# EAGLE schematic ATtiny84 (EAGLE 6.4)
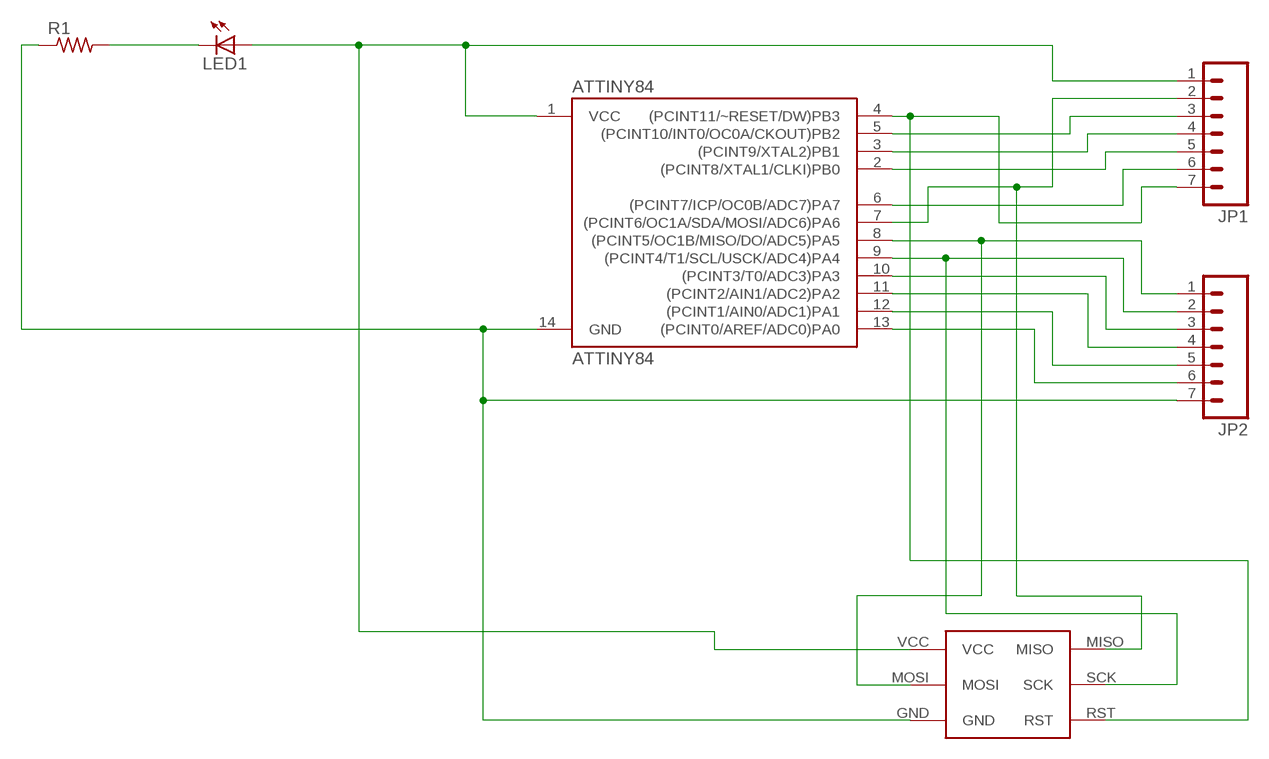
[diagram p0: schematic, sheet 1]

## Parts
ATTINY84  ATTINY84  [SO14]
JP1  M07  [1X07]
JP2  M07  [1X07]
LED1  LEDSML0603  [SML0603]
R1  R-US_R0805W  [R0805W]
U$2  POGO_PIN_SPI_PAD  [POGO_PIN_SPI_PAD]

## Nets
GND: ATTINY84.14(GND) JP2.7 R1.1 U$2.GND
N$1: LED1.C R1.2
PA0: ATTINY84.13((PCINT0/AREF/ADC0)PA0) JP2.6
PA1: ATTINY84.12((PCINT1/AIN0/ADC1)PA1) JP2.5
PA2: ATTINY84.11((PCINT2/AIN1/ADC2)PA2) JP2.4
PA3: ATTINY84.10((PCINT3/T0/ADC3)PA3) JP2.3
PA4: ATTINY84.9((PCINT4/T1/SCL/USCK/ADC4)PA4) JP2.2 U$2.SCK
PA5: ATTINY84.8((PCINT5/OC1B/MISO/DO/ADC5)PA5) JP2.1 U$2.MOSI
PA6: ATTINY84.7((PCINT6/OC1A/SDA/MOSI/ADC6)PA6) JP1.2 U$2.MISO
PA7: ATTINY84.6((PCINT7/ICP/OC0B/ADC7)PA7) JP1.6
PB0: ATTINY84.2((PCINT8/XTAL1/CLKI)PB0) JP1.5
PB1: ATTINY84.3((PCINT9/XTAL2)PB1) JP1.4
PB2: ATTINY84.5((PCINT10/INT0/OC0A/CKOUT)PB2) JP1.3
PB3: ATTINY84.4((PCINT11/~RESET/DW)PB3) JP1.7 U$2.RST
VCC: ATTINY84.1(VCC) JP1.1 LED1.A U$2.VCC

## Library data of the parts
ATTINY84 = SparkFun-DigitalIC:ATTINY84: Atmel 14-pin 2/4/8kB flash uC
JP1 JP2 = SparkFun-Connectors:M07: Header 7 Standard 7-pin 0.1" header. Use with straight break away headers (SKU : PRT-00116), right angle break away headers (PRT-00553), swiss pins (PRT-00743), machine pins (PRT-00117), and female headers (PRT-00115). NOTES ON THE VARIANTS LOCK and LOCK_LONGPADS... This footprint was designed to help hold the alignment of a through-hole component (i.e. 7-pin header) while soldering it into place. You may notice that each hole has been shifted either up or down by 0.005 of an inch from it's more standard position (which is usually a perfectly straight line). This slight alteration caused the pins (the squares in the middle) to touch the edges of the holes. Because they are alternating, it causes a "brace" to hold the header in place. 0.005 has proven to be the perfect amount of "off-center" position when using our standard breakaway headers. Although looks a little odd when you look at the bare footprint, once you have a header in there, the alteration is very hard to notice. Also, if you push a header all the way into place, it is covered up entirely on the bottom side. This idea of altering the position of holes to aid alignment will be further integrated into the Sparkfun Library for other footprints. It can help hold any component with 3 or more connection pins.
LED1 = led:LED: LED OSRAM: - CHIPLED LG R971, LG N971, LY N971, LG Q971, LY Q971, LO R971, LY R971 LH N974, LH R974 LS Q976, LO Q976, LY Q976 LO Q996 - Hyper CHIPLED LW Q18S LB Q993, LB Q99A, LB R99A - SideLED LS A670, LO A670, LY A670, LG A670, LP A670 LB A673, LV A673, LT A673, LW A673 LH A674 LY A675 LS A676, LA A676, LO A676, LY A676, LW A676 LS A679, LY A679, LG A679 - Hyper Micro SIDELED® LS Y876, LA Y876, LO Y876, LY Y876 LT Y87S - SmartLED LW L88C, LW L88S LB L89C, LB L89S, LG L890 LS L89K, LO L89K, LY L89K LS L896, LA L896, LO L896, LY L896 - TOPLED LS T670, LO T670, LY T670, LG T670, LP T670 LSG T670, LSP T670, LSY T670, LOP T670, LYG T670 LG T671, LOG T671, LSG T671 LB T673, LV T673, LT T673, LW T673 LH T674 LS T676, LA T676, LO T676, LY T676, LB T676, LH T676, LSB T676, LW T676 LB T67C, LV T67C, LT T67C, LS T67K, LO T67K, LY T67K, LW E67C LS E67B, LA E67B, LO E67B, LY E67B, LB E67C, LV E67C, LT E67C LW T67C LS T679, LY T679, LG T679 LS T770, LO T770, LY T770, LG T770, LP T770 LB T773, LV T773, LT T773, LW T773 LH T774 LS E675, LA E675, LY E675, LS T675 LS T776, LA T776, LO T776, LY T776, LB T776 LHGB T686 LT T68C, LB T68C - Hyper Mini TOPLED® LB M676 - Mini TOPLED Santana® LG M470 LS M47K, LO M47K, LY M47K Source: http://www.osram.convergy.de LUXEON: - LUMILED® LXK2-PW12-R00, LXK2-PW12-S00, LXK2-PW14-U00, LXK2-PW14-V00 LXK2-PM12-R00, LXK2-PM12-S00, LXK2-PM14-U00 LXK2-PE12-Q00, LXK2-PE12-R00, LXK2-PE12-S00, LXK2-PE14-T00, LXK2-PE14-U00 LXK2-PB12-K00, LXK2-PB12-L00, LXK2-PB12-M00, LXK2-PB14-N00, LXK2-PB14-P00, LXK2-PB14-Q00 LXK2-PR12-L00, LXK2-PR12-M00, LXK2-PR14-Q00, LXK2-PR14-R00 LXK2-PD12-Q00, LXK2-PD12-R00, LXK2-PD12-S00 LXK2-PH12-R00, LXK2-PH12-S00 LXK2-PL12-P00, LXK2-PL12-Q00, LXK2-PL12-R00 Source: www.luxeon.com KINGBRIGHT: KA-3528ASYC Source: www.kingbright.com
R1 = resistor:R-US_: RESISTOR, American symbol
U$2 = Random parts:POGO_PIN_SPI_PAD